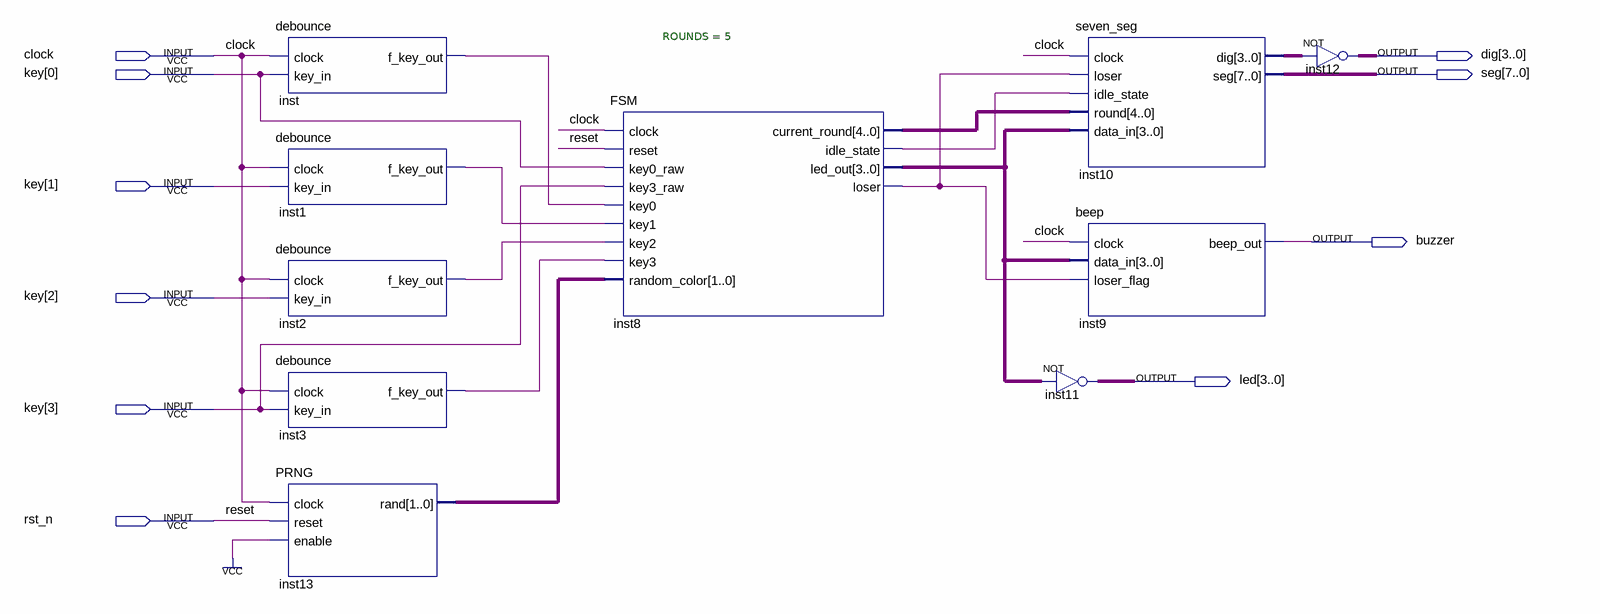
[diagram p0: schematic sheet]
// Quartus schematic subtop_test.bdf as structural Verilog: 10 symbols, 10 pins
module subtop_test (
  input  clock,
  input  [3:0] key,
  input  rst_n,
  output [3:0] dig,
  output [7:0] seg,
  output buzzer,
  output [3:0] led
);

  wire inst1_f_key_out, inst2_f_key_out, inst3_f_key_out, inst8_idle_state, inst8_loser, inst_f_key_out;
  wire [1:0] inst13_rand;
  wire [3:0] inst8_led_out, inst10_dig;
  wire [4:0] inst8_current_round;

  debounce inst (.clock(clock), .key_in(key[0]), .f_key_out(inst_f_key_out));
  debounce inst1 (.clock(clock), .key_in(key[1]), .f_key_out(inst1_f_key_out));
  debounce inst2 (.clock(clock), .key_in(key[2]), .f_key_out(inst2_f_key_out));
  debounce inst3 (.clock(clock), .key_in(key[3]), .f_key_out(inst3_f_key_out));
  PRNG inst13 (.clock(clock), .reset(rst_n), .enable(1'b1), .\rand (inst13_rand));
  FSM #(.ROUNDS(5)) inst8 (
    .clock(clock), .reset(rst_n), .key0_raw(key[0]), .key3_raw(key[3]), .key0(inst_f_key_out),
    .key1(inst1_f_key_out), .key2(inst2_f_key_out), .key3(inst3_f_key_out), .random_color(inst13_rand),
    .current_round(inst8_current_round), .idle_state(inst8_idle_state), .led_out(inst8_led_out),
    .loser(inst8_loser));
  seven_seg inst10 (
    .clock(clock), .loser(inst8_loser), .idle_state(inst8_idle_state), .round(inst8_current_round),
    .data_in(inst8_led_out), .dig(inst10_dig), .seg(seg));
  beep inst9 (.clock(clock), .data_in(inst8_led_out), .loser_flag(inst8_loser), .beep_out(buzzer));
  assign led = ~inst8_led_out;  // NOT inst11, 4 bits wide
  assign dig = ~inst10_dig;  // NOT inst12, 4 bits wide

  // Other names for the same wires on the sheet: reset = rst_n
endmodule
